# EAGLE schematic 8led-indicator (EAGLE 9.5.1)
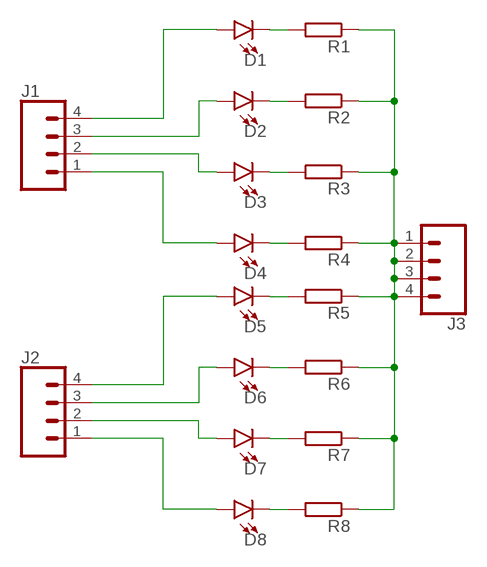
[diagram p0: schematic, sheet 1]

## Parts
D1  LED0603  [LED-0603]
D2  LED0603  [LED-0603]
D3  LED0603  [LED-0603]
D4  LED0603  [LED-0603]
D5  LED0603  [LED-0603]
D6  LED0603  [LED-0603]
D7  LED0603  [LED-0603]
D8  LED0603  [LED-0603]
J1  CONN_04LOCK  [1X04_LOCK]
J2  CONN_04LOCK  [1X04_LOCK]
J3  CONN_04LOCK  [1X04_LOCK]
R1  RESISTOR-EU_R0603  [R0603]
R2  RESISTOR-EU_R0603  [R0603]
R3  RESISTOR-EU_R0603  [R0603]
R4  RESISTOR-EU_R0603  [R0603]
R5  RESISTOR-EU_R0603  [R0603]
R6  RESISTOR-EU_R0603  [R0603]
R7  RESISTOR-EU_R0603  [R0603]
R8  RESISTOR-EU_R0603  [R0603]

## Nets
GND: J3.1 J3.2 J3.3 J3.4 R1.1 R2.1 R3.1 R4.1 R5.1 R6.1 R7.1 R8.1
N$1: D1.A J1.4
N$2: D2.A J1.3
N$3: D3.A J1.2
N$4: D4.A J1.1
N$5: D1.C R1.2
N$6: D2.C R2.2
N$7: D3.C R3.2
N$8: D4.C R4.2
N$9: D5.A J2.4
N$10: D6.A J2.3
N$11: D7.A J2.2
N$12: D8.A J2.1
N$13: D5.C R5.2
N$14: D6.C R6.2
N$15: D7.C R7.2
N$16: D8.C R8.2

## Library data of the parts
D1-D8 = SparkFun-LED:LED: LED (Generic) Standard schematic elements and footprints for 5mm, 3mm, 1206, and 0603 sized LEDs. Generic LEDs with no color specified.
J1-J3 = SparkFun-Connectors:CONN_04: Multi connection point. Often used as Generic Header-pin footprint for 0.1 inch spaced/style header connections On any of the 0.1 inch spaced packages, you can populate with these: Break Away Headers - Straight <https://www.sparkfun.com/products/116> (PRT-00116) Break Away Male Headers - Right Angle <https://www.sparkfun.com/products/553> (PRT-00553) Female Headers <https://www.sparkfun.com/products/115> (PRT-00115) Break Away Headers - Machine Pin <https://www.sparkfun.com/products/117> (PRT-00117) Break Away Female Headers - Swiss Machine Pin <https://www.sparkfun.com/products/743> (PRT-00743) For SCREWTERMINALS and SPRING TERMINALS visit here: Screw Terimnals on SparkFun.com <https://www.sparkfun.com/search/results?term=Screw+Terminals> (5mm/3.5mm/2.54mm spacing) This device is also useful as a general connection point to wire up your design to another part of your project. Our various solder wires solder well into these plated through hole pads. Hook-Up Wire - Assortment (Stranded, 22 AWG) <https://www.sparkfun.com/products/11375> (PRT-11375) Hook-Up Wire - Assortment (Solid Core, 22 AWG) <https://www.sparkfun.com/products/11367> (PRT-11367) View the entire wire category on our website here <https://www.sparkfun.com/categories/141> Special notes: Molex polarized connector foot print use with SKU : PRT-08231 with associated crimp pins and housings. 1MM SMD Version SKU: PRT-10208; PROD_ID: CONN-09696
R1-R8 = 0000-master:RESISTOR-EU_: RESISTOR, European symbol